# Altium project BC8SATEV1.0.PrjPCB
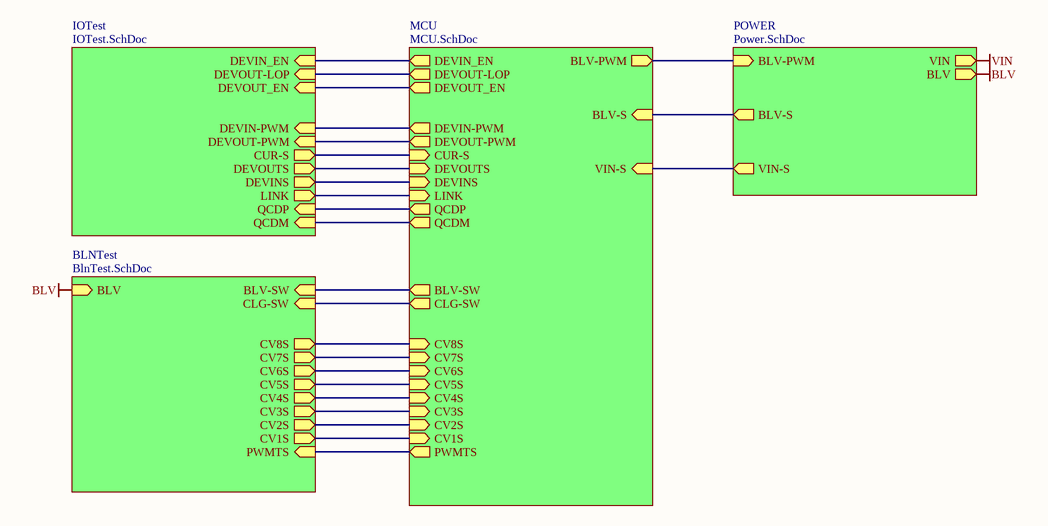
[diagram p0: Connection.SchDoc]
5 sheets, 346 parts. Net scope: hierarchical (ports join the sheet entries above them; power ports are global).
Board file: SCATEV33.PcbDoc
Sheets:
  Connection.SchDoc
    IOTest = IOTest.SchDoc
    MCU = MCU.SchDoc
    POWER = Power.SchDoc
    BLNTest = BlnTest.SchDoc

## Sheet Connection.SchDoc
size A4; DocumentNumber: 1; SheetNumber: 2; SheetTotal: 5

### Sub-sheets
BLNTest = BlnTest.SchDoc: BLV-SW (in), BLV (in), CLG-SW (in), CV5S (out), CV6S (out), CV7S (out), CV8S (out), CV3S (out), CV4S (out), CV2S (out), CV1S (out), PWMTS (in)
IOTest = IOTest.SchDoc: DEVINS (out), DEVOUTS (out), CUR-S (out), DEVOUT-LOP (in), DEVIN_EN (in), LINK (out), QCDP (in), QCDM (in), DEVOUT_EN (in), DEVIN-PWM (in), DEVOUT-PWM (in)
MCU = MCU.SchDoc: CV5S (in), CV6S (in), CV1S (in), CV7S (in), CV8S (in), CV3S (in), CV4S (in), CV2S (in), DEVOUTS (in), CUR-S (in), DEVINS (in), BLV-S (in), CLG-SW (out), BLV-SW (out), DEVOUT-LOP (out), DEVIN_EN (out), BLV-PWM (out), LINK (in), PWMTS (out), QCDP (out), QCDM (out), VIN-S (in), DEVOUT_EN (out), DEVIN-PWM (out), DEVOUT-PWM (out)
POWER = Power.SchDoc: BLV-PWM (in), BLV (out), BLV-S (out), VIN (out), VIN-S (out)

### Nets
BLV: sheet POWER/BLV, sheet BLNTest/BLV
BLV-SW: sheet MCU/BLV-SW, sheet BLNTest/BLV-SW
CLGC: sheet MCU/CLG-SW, sheet BLNTest/CLG-SW
QCDM: sheet IOTest/QCDM, sheet MCU/QCDM
QCDP: sheet IOTest/QCDP, sheet MCU/QCDP
NetC6_2: sheet MCU/CV7S, sheet BLNTest/CV7S
NetC7_2: sheet MCU/CV8S, sheet BLNTest/CV8S
NetC8_2: sheet MCU/CV5S, sheet BLNTest/CV5S
NetC9_2: sheet MCU/CV6S, sheet BLNTest/CV6S
NetC10_2: sheet MCU/CV3S, sheet BLNTest/CV3S
NetC11_2: sheet MCU/CV4S, sheet BLNTest/CV4S
NetC12_2: sheet MCU/CV1S, sheet BLNTest/CV1S
NetC13_2: sheet MCU/CV2S, sheet BLNTest/CV2S
NetC15_2: sheet IOTest/DEVOUTS, sheet MCU/DEVOUTS
NetC17_2: sheet IOTest/CUR-S, sheet MCU/CUR-S
NetC27_2: sheet MCU/BLV-S, sheet POWER/BLV-S
NetC47_2: sheet IOTest/DEVINS, sheet MCU/DEVINS
NetC64_2: sheet MCU/VIN-S, sheet POWER/VIN-S
NetP2_3: sheet IOTest/LINK, sheet MCU/LINK
NetQ5_1: sheet IOTest/DEVIN-PWM, sheet MCU/DEVIN-PWM
NetQ17_1: sheet IOTest/DEVOUT_EN, sheet MCU/DEVOUT_EN
NetQ18_1: sheet IOTest/DEVOUT-PWM, sheet MCU/DEVOUT-PWM
NetQ43_1: sheet IOTest/DEVOUT-LOP, sheet MCU/DEVOUT-LOP
NetQ47_1: sheet MCU/BLV-PWM, sheet POWER/BLV-PWM
NetQ53_1: sheet MCU/PWMTS, sheet BLNTest/PWMTS
NetR43_2: sheet IOTest/DEVIN_EN, sheet MCU/DEVIN_EN

## Sheet IOTest.SchDoc
size A3; DocumentNumber: 5; SheetNumber: 5; SheetTotal: 5
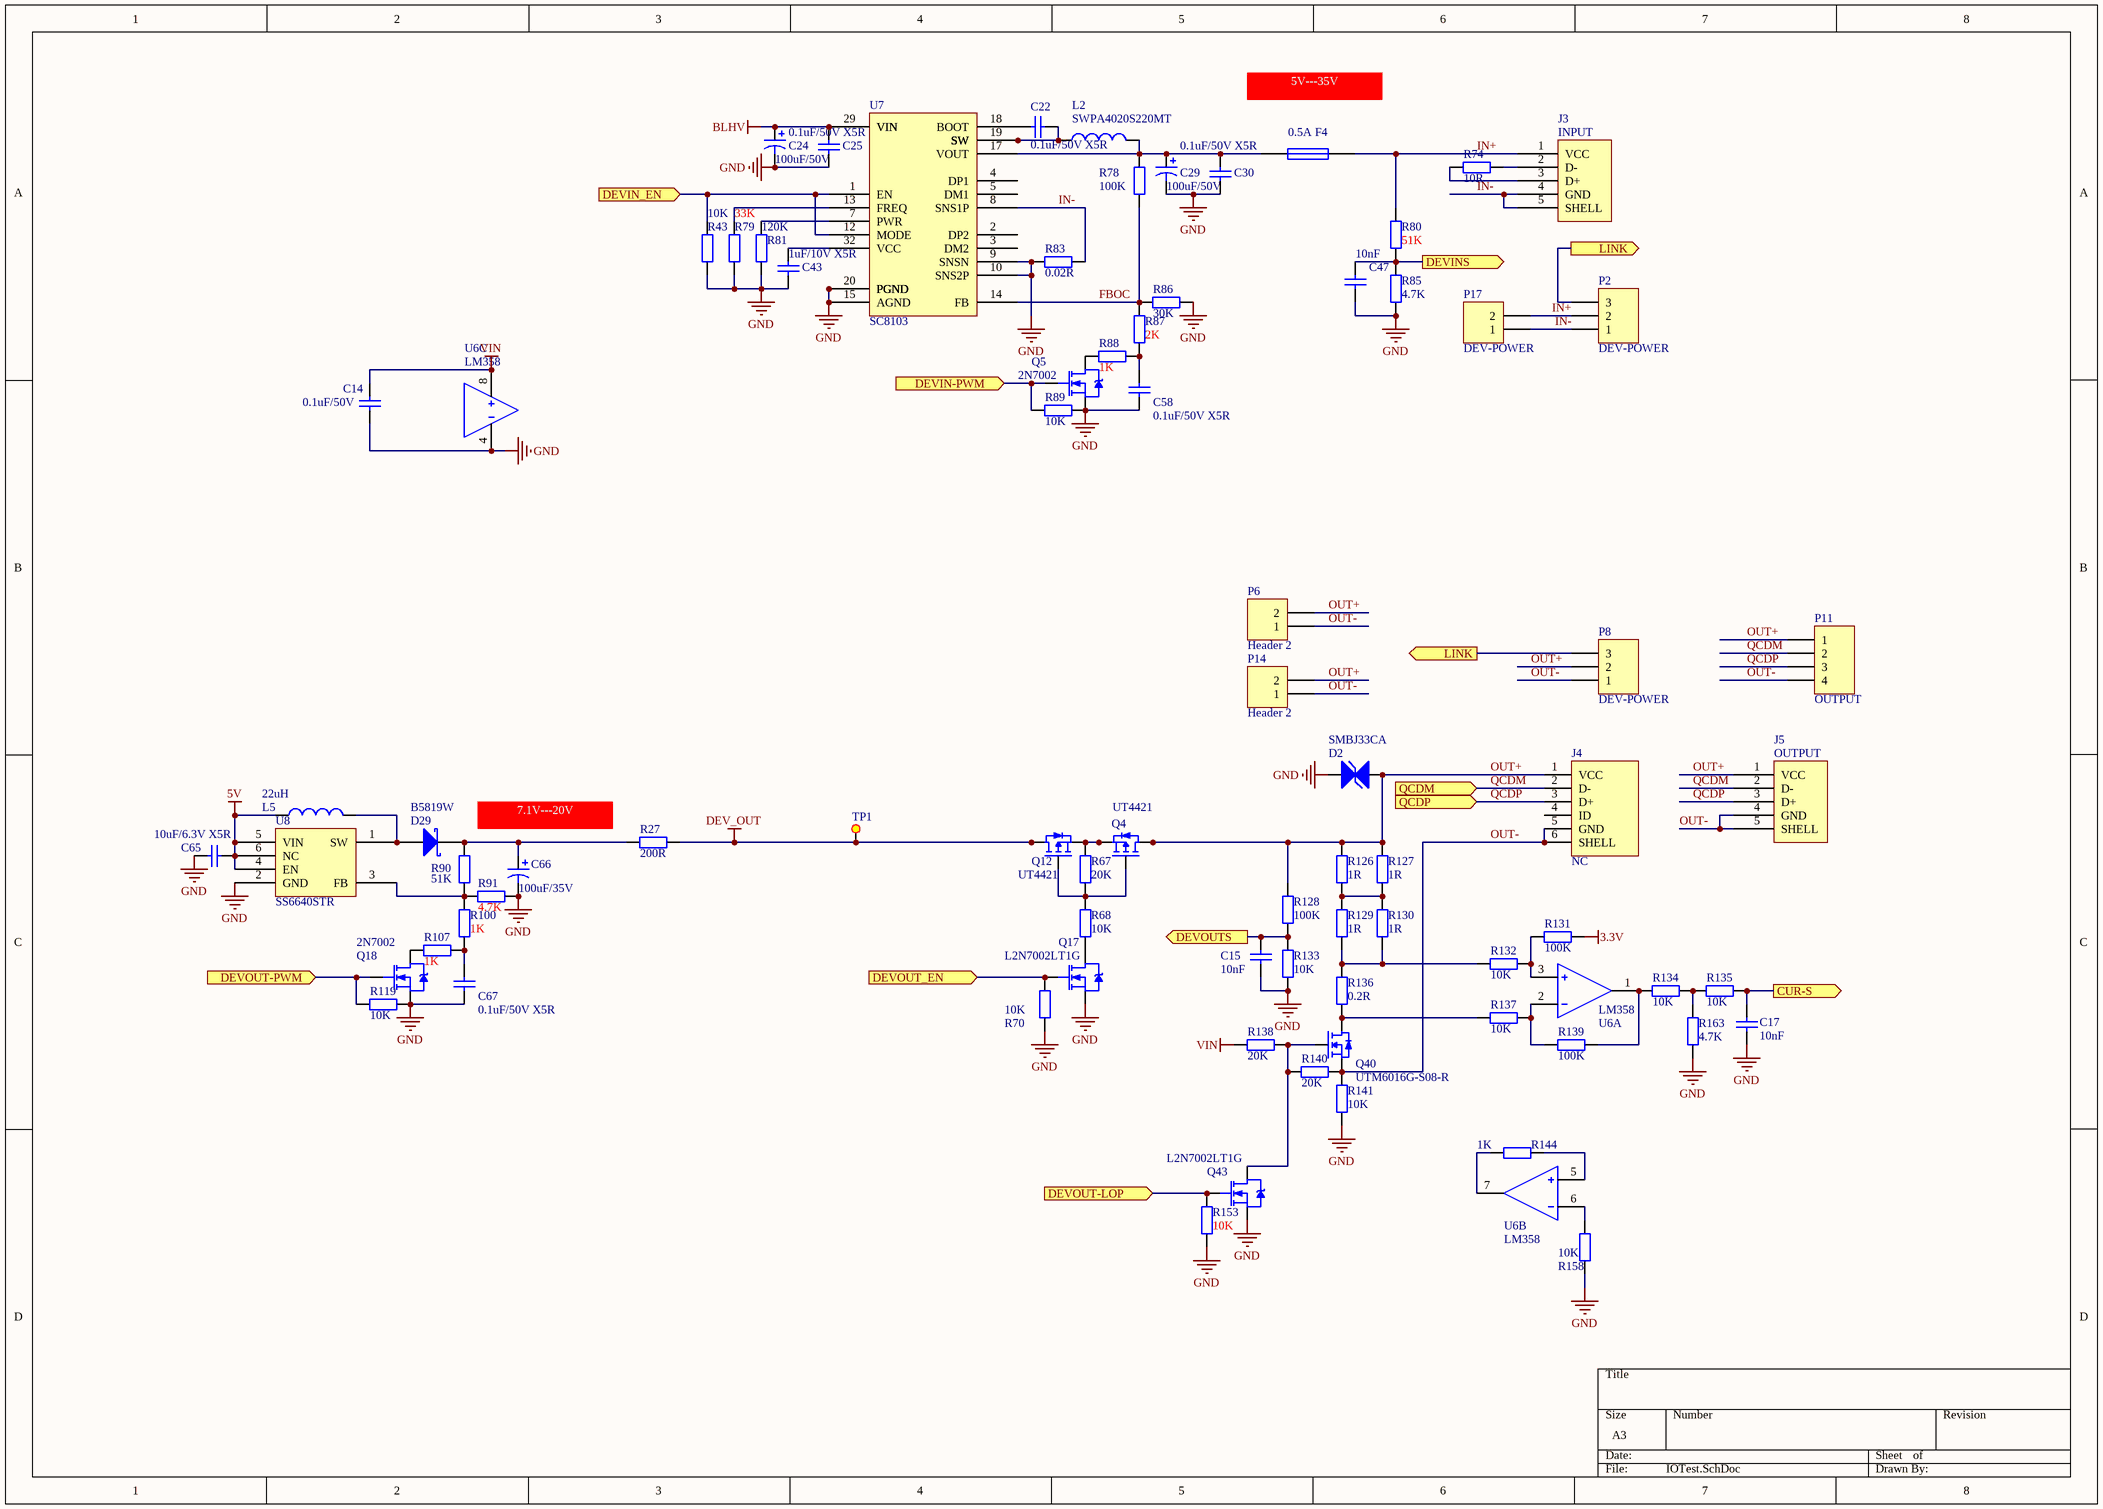
[diagram p1: IOTest.SchDoc]

### Parts
C14  0.1uF/50V  [C-0603]
C15  10nF  [C-0603]
C17  10nF  [C-0603]
C22  0.1uF/50V X5R  [C-0603]
C24  100uF/50V  [CAPPR-8x12]
C25  0.1uF/50V X5R  [C-0603]
C29  100uF/50V  [CAPPR-8x12]
C30  0.1uF/50V X5R  [C-0603]
C43  1uF/10V X5R  [C-0603]
C47  10nF  [C-0603]
C58  0.1uF/50V X5R  [C-0603]
C65  10uF/6.3V X5R  [C-0603]
C66  100uF/35V  [CAP-SMD-6.3x7.7]
C67  0.1uF/50V X5R  [C-0603]
D2  SMBJ33CA  [SMBJ]
D29  B5819W  [SOD-123FL]
F4  0.5A  [R-1206]
J3  INPUT  [ST-001-15A-1.0]
J4  NC  [ST-MICROUSB-03A]
J5  OUTPUT  [ST-001-15A-1.0]
L2  SWPA4020S220MT  [SWPA4020S]
L5  22uH  [DG3521]
P2  DEV-POWER  [XH 2.54-3P]
P6  Header 2  [XH 2.54-2P]
P8  DEV-POWER  [XH 2.54-3P]
P11  OUTPUT  [XH 2.54-4P]
P14  Header 2  [XH 2.54-2P]
P17  DEV-POWER  [XH 2.54-2P]
Q4  UT4421  [SOIC8]
Q5  2N7002  [SOT23-3]
Q12  UT4421  [SOIC8]
Q17  L2N7002LT1G  [SOT23-3]
Q18  2N7002  [SOT23-3]
Q40  UTM6016G-S08-R  [SOIC8]
Q43  L2N7002LT1G  [SOT23-3]
R27  200R  [R-0805]
R43  10K  [R-0603]
R67  20K  [R-0603]
R68  10K  [R-0603]
R70  10K  [R-0603]
R74  10R  [R-0603]
R78  100K  [R-0603]
R79  33K  [R-0603]
R80  51K  [R-0603]
R81  120K  [R-0603]
R83  0.02R  [R-2010]
R85  4.7K  [R-0603]
R86  30K  [R-0603]
R87  2K  [R-0603]
R88  1K  [R-0603]
R89  10K  [R-0603]
R90  51K  [R-0603]
R91  4.7K  [R-0603]
R100  1K  [R-0603]
R107  1K  [R-0603]
R119  10K  [R-0603]
R126  1R  [R-2512]
R127  1R  [R-2512]
R128  100K  [R-0603]
R129  1R  [R-2512]
R130  1R  [R-2512]
R131  100K  [R-0603]
R132  10K  [R-0603]
R133  10K  [R-0603]
R134  10K  [R-0603]
R135  10K  [R-0603]
R136  0.2R  [R-2512HP]
R137  10K  [R-0603]
R138  20K  [R-0603]
R139  100K  [R-0603]
R140  20K  [R-0603]
R141  10K  [R-0603]
R144  1K  [R-0603]
R153  10K  [R-0603]
R158  10K  [R-0603]
R163  4.7K  [R-0603]
TP1  (no value)  [TestPoint-1.5mm]
U6  LM358  [SOIC8]  (parts A,B,C of 3)
U7  SC8103  [SC8103]
U8  SS6640STR  [SOT23-6]

### Ports
CUR-S (out), DEVIN-PWM (in), DEVIN_EN (in), DEVINS (out), DEVOUT-LOP (in), DEVOUT-PWM (in), DEVOUT_EN (in), DEVOUTS (out), LINK (out), QCDM (in), QCDP (in)

### Nets
3.3V: R131.2
5V: C65.2 L5.1 U8.4(EN) U8.5(VIN) U8.6(NC)
BLHV: C24.1 C25.2 U7.29(VIN) U7.30(VIN) U7.31(VIN)
DEV_OUT: Q12.5(D) Q12.6(D) Q12.7(D) Q12.8(D) R27.2 TP1.1
GND: C14.2 C15.1 C17.1 C24.2 C25.1 C29.2 C30.1 C43.1 C47.1 C58.2 C65.1 C66.2 C67.2 D2.1 Q5.2(D) Q17.2(D) Q18.2(D) Q43.2(D) R43.1 R70.1 R79.1 R81.1 R83.1 R85.1 R86.1 R89.1 R91.2 R119.1 R133.1 R141.2 R153.2 R158.2 R163.1 U6.4 U7.9(SNSN) U7.10(SNS2P) U7.15(AGND) U7.20(PGND) U7.21(PGND) U7.22(PGND) U7.23(PGND) U7.24(PGND) U8.2(GND)
VIN: C14.1 R138.1 U6.8
FBOC: R78.2 R86.2 R87.2 U7.14(FB)
IN+: F4.2 J3.1(VCC) P2.2 P17.2 R80.2
IN-: J3.4(GND) J3.5(SHELL) P2.1 P17.1 R83.2 U7.8(SNS1P)
OUT+: D2.2 J4.1(VCC) J5.1(VCC) P6.2 P8.2 P11.1 P14.2 Q4.5(D) Q4.6(D) Q4.7(D) Q4.8(D) R126.1 R127.2 R128.2
OUT-: J4.5(GND) J4.6(SHELL) J5.4(GND) J5.5(SHELL) P6.1 P8.1 P11.4 P14.1 Q40.1(S) Q40.2(S) Q40.3(S) R140.2 R141.1
QCDM: J4.2(D-) J5.2(D-) P11.2 ; port QCDM
QCDP: J4.3(D+) J5.3(D+) P11.3 ; port QCDP
NetC15_2: C15.2 R128.1 R133.2 ; port DEVOUTS
NetC17_2: C17.2 R135.2 ; port CUR-S
NetC22_1: C22.1 L2.1 U7.16(SW) U7.19(SW) U7.25(SW) U7.26(SW) U7.27(SW) U7.28(SW)
NetC22_2: C22.2 U7.18(BOOT)
NetC29_1: C29.1 C30.2 F4.1 L2.2 R78.1 U7.17(VOUT)
NetC43_2: C43.2 U7.32(VCC)
NetC47_2: C47.2 R80.1 R85.2 ; port DEVINS
NetC58_1: C58.1 R87.1 R88.1
NetC66_1: C66.1 D29.2(K) R27.1 R90.1
NetC67_1: C67.1 R100.1 R107.1
NetD29_1: D29.1(A) L5.2 U8.1(SW)
NetJ3_2: J3.2(D-) R74.1
NetJ3_3: J3.3(D+) R74.2
NetP2_3: P2.3 P8.3 ; port LINK
NetQ4_1: Q4.1(S) Q4.2(S) Q4.3(S) Q12.1(S) Q12.2(S) Q12.3(S) R67.2
NetQ4_4: Q4.4(G) Q12.4(G) R67.1 R68.2
NetQ5_1: Q5.1(G) R89.2 ; port DEVIN-PWM
NetQ5_3: Q5.3(S) R88.2
NetQ17_1: Q17.1(G) R70.2 ; port DEVOUT_EN
NetQ17_3: Q17.3(S) R68.1
NetQ18_1: Q18.1(G) R119.2 ; port DEVOUT-PWM
NetQ18_3: Q18.3(S) R107.2
NetQ40_4: Q40.4(G) Q43.3(S) R138.2 R140.1
NetQ40_5: Q40.5(D) Q40.6(D) Q40.7(D) Q40.8(D) R136.1 R137.1
NetQ43_1: Q43.1(G) R153.1 ; port DEVOUT-LOP
NetR43_2: R43.2 U7.1(EN) U7.12(MODE) ; port DEVIN_EN
NetR79_2: R79.2 U7.13(FREQ)
NetR81_2: R81.2 U7.7(PWR)
NetR90_2: R90.2 R91.1 R100.2 U8.3(FB)
NetR126_2: R126.2 R127.1 R129.2 R130.1
NetR129_1: R129.1 R130.2 R132.1 R136.2
NetR131_1: R131.1 R132.2 U6.3
NetR134_1: R134.1 R139.2 U6.1
NetR134_2: R134.2 R135.1 R163.2
NetR137_2: R137.2 R139.1 U6.2
NetR144_1: R144.1 U6.5
NetR144_2: R144.2 U6.7
NetR158_1: R158.1 U6.6

Not connected (* = marked no-connect by the designer): J4 4(ID); U7 2(DP2) 3(DM2) 4(DP1) 5(DM1)

### Notes on the sheet
- 5V---35V
- 7.1V---20V

### Library data of the parts
C14 C15 C17 C22 C25 C30 C43 C47 C58 C65 C67 = Cap: Capacitor; Published: 8-Jun-2000; LatestRevisionDate: 17-Jul-2002; LatestRevisionNote: Re-released for DXP Platform.; PackageReference: RAD-0.3; Publisher: Altium Limited
  C14: Value: 0.1uF/50V
  C15 C17 C47: Value: 10nF
  C22 C25 C30 C58 C67: PackageDescription: Radial Cap, Thru-Hole; 2 Leads; 0.3 in Pin Spacing; Value: 0.1uF/50V X5R
  C43: PackageDescription: Radial Cap, Thru-Hole; 2 Leads; 0.3 in Pin Spacing; Value: 1uF/10V X5R
  C65: PackageDescription: Radial Cap, Thru-Hole; 2 Leads; 0.3 in Pin Spacing; Value: 10uF/6.3V X5R
C24 C29 C66 = Cap Pol1: Polarized Capacitor (Radial); Published: 8-Jun-2000; LatestRevisionDate: 17-Jul-2002; LatestRevisionNote: Re-released for DXP Platform.; PackageReference: RB7.6-15; Publisher: Altium Limited; PackageDescription: Polarized Capacitor (Radial); 2 Leads
  C24 C29: Value: 100uF/50V
  C66: Value: 100uF/35V
D2 = TVS-D
D29 = D Schottky: Schottky Diode; Published: 8-Jun-2000; LatestRevisionDate: 17-Jul-2002; LatestRevisionNote: Re-released for DXP Platform.; PackageReference: SMB; Publisher: Altium Limited; Code_JEDEC: DO-214-AA
F4 = Fuse 1: Fuse; Published: 8-Jun-2000; LatestRevisionDate: 17-Jul-2002; LatestRevisionNote: Re-released for DXP Platform.; PackageReference: PIN-W2/E2.8; Publisher: Altium Limited; PackageDescription: Thru-Hole; 2 Leads
J3 J5 = USB-CON: USB CONNECTOR
J4 = MICRO-USB-B
L2 L5 = Inductor: Code_IEC: 1005; Published: 8-Jun-2000; LatestRevisionDate: 29-May-2009; LatestRevisionNote: IPC-7351 Footprint Added.; PackageReference: 0402-A; Publisher: Altium Limited; PackageDescription: Chip Inductor; Code_JEITA: 0402
  L2: Value: SWPA4020S220MT
  L5: Value: 22uH
P2 P8 = Header 3: Header, 3-Pin; LatestRevisionDate: 17-Jul-2002; LatestRevisionNote: Re-released for DXP Platform.; Publisher: Altium Limited
P6 P14 P17 = Header 2: Header, 2-Pin; LatestRevisionDate: 17-Jul-2002; LatestRevisionNote: Re-released for DXP Platform.; Publisher: Altium Limited
P11 = Header 4: Header, 4-Pin; LatestRevisionDate: 17-Jul-2002; LatestRevisionNote: Re-released for DXP Platform.; Publisher: Altium Limited
Q4 Q12 = SO8-PMOS
Q5 Q17 Q18 Q43 = NMOS-2: N-Channel Power MOSFET; Note: Pin 2 is electrically connected to pin 4.; Published: 8-Jun-2000; LatestRevisionDate: 17-Jul-2002; LatestRevisionNote: Re-released for DXP Platform.; DatasheetVersion: PD-9.814; PackageVersion: Feb-1997; PackageReference: TO-220AB; Publisher: Altium Limited; PackageDescription: TO, Thru-Hole, Vertical, Heatsink Mounted; 3 In-Line Leads; Pitch 2.54 mm; ComponentLink1Description: Manufacturer Link; ComponentLink1URL: http://www.irf.com/
Q40 = SO8-NMOS
R27 R43 R67 R68 R70 R74 R78-R81 R83 R85-R91 R100 R107 R119 R126-R141 R144 R153 R158 R163 = Res2: Resistor; Published: 8-Jun-2000; LatestRevisionDate: 17-Jul-2002; LatestRevisionNote: Re-released for DXP Platform.; PackageReference: AXIAL-0.4; Publisher: Altium Limited
  R27: Value: 200R
  R43 R68 R70 R89 R119 R132-R135 R137 R141 R153 R158: Value: 10K
  R67 R138 R140: Value: 20K
  R74: Value: 10R
  R78 R128 R131 R139: Value: 100K
  R79: Value: 33K
  R80 R90: Value: 51K
  R81: Value: 120K
  R83: Value: 0.02R
  R85 R91 R163: Value: 4.7K
  R86: Value: 30K
  R87: Value: 2K
  R88 R100 R107 R144: Value: 1K
  R126 R127 R129 R130: Value: 1R
  R136: Value: 0.2R
TP1 = TEST_P
U6 = Dual_OPAMP
U8 = AX5523

## Sheet MCU.SchDoc
size A2; DocumentNumber: 2; SheetNumber: 1; SheetTotal: 5
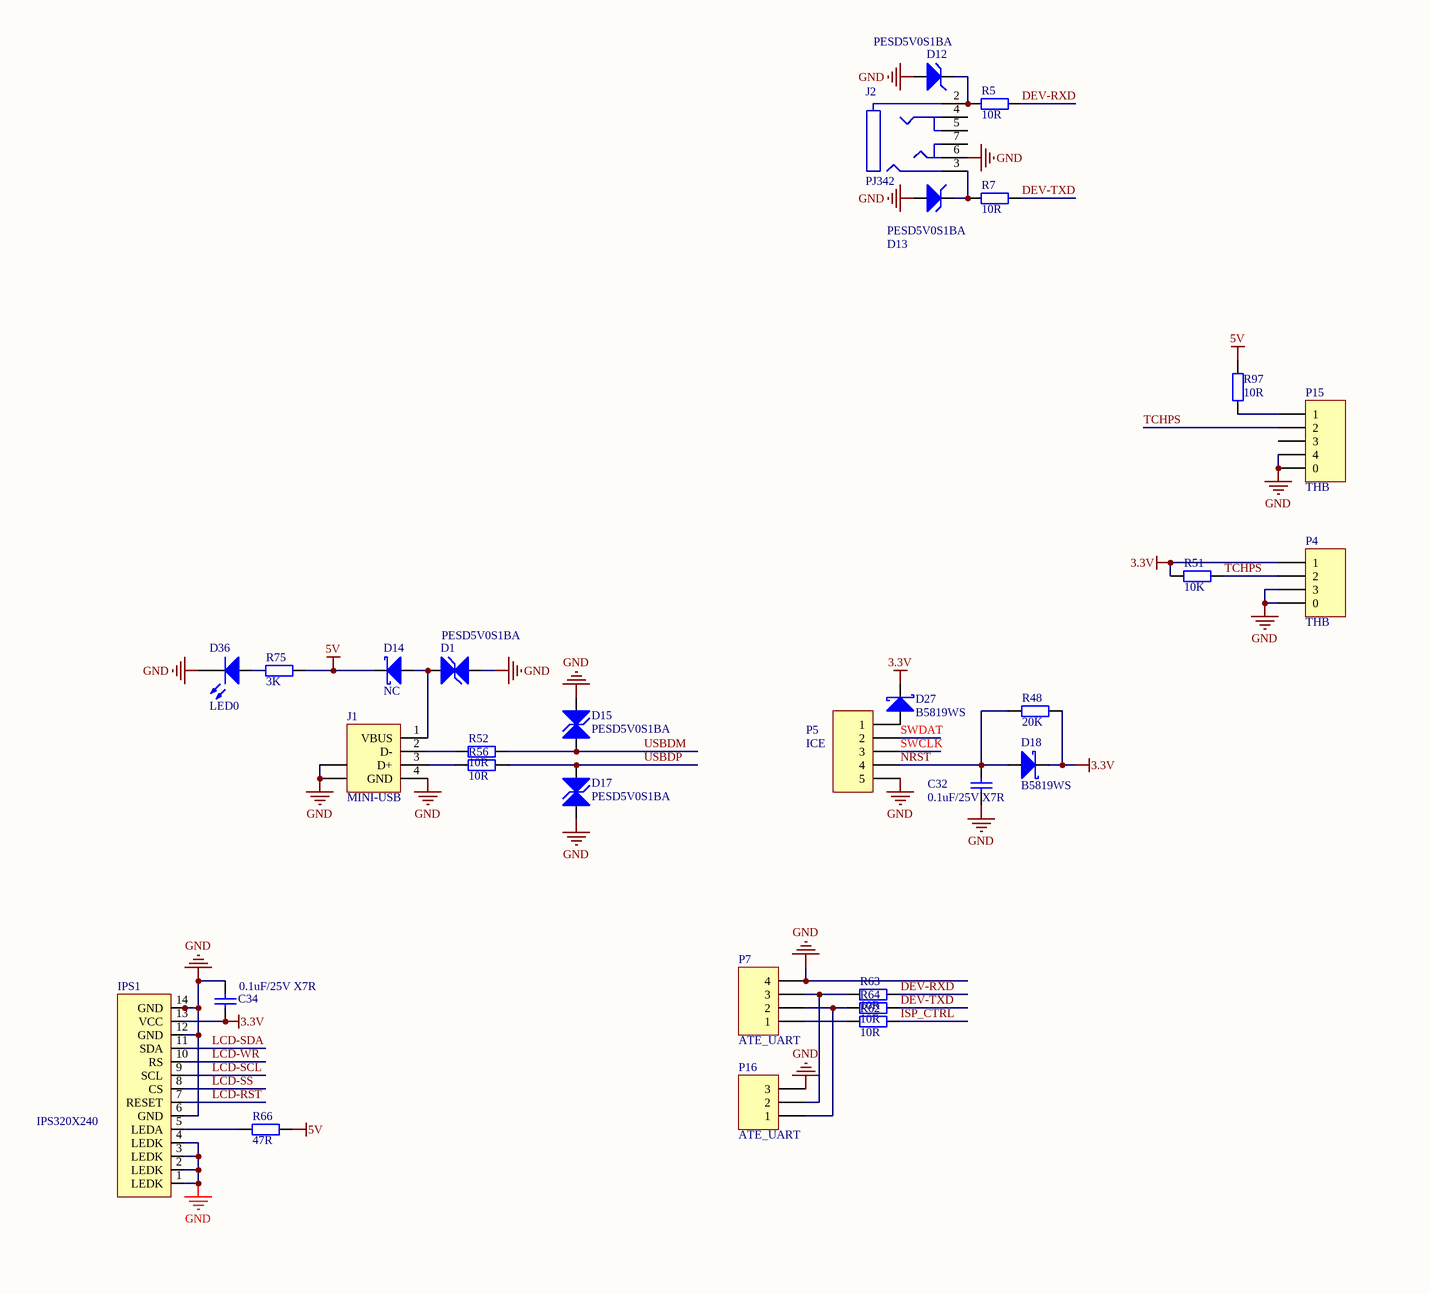
[diagram p2: MCU.SchDoc, left]
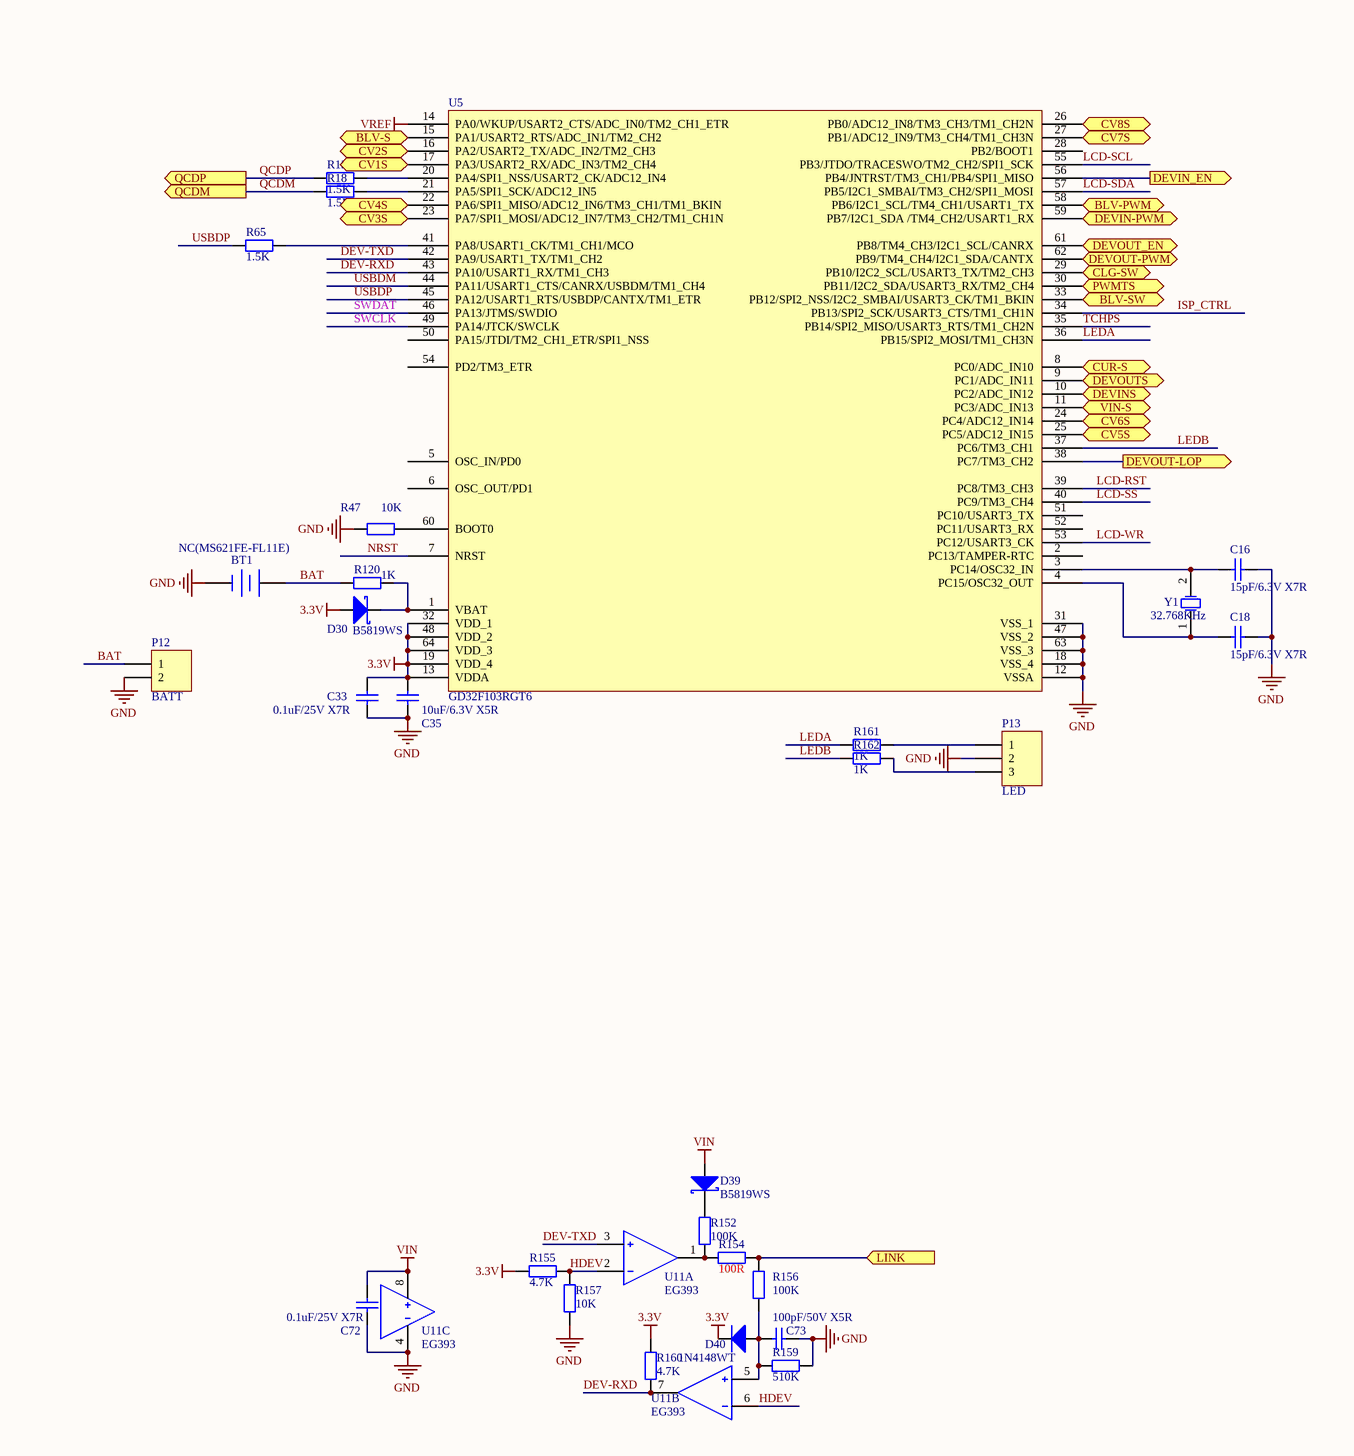
[diagram p3: MCU.SchDoc, right]

### Parts
BT1  NC(MS621FE-FL11E)  [MS621FE FL11E]
C16  15pF/6.3V X7R  [C-0603]
C18  15pF/6.3V X7R  [C-0603]
C32  0.1uF/25V X7R  [C-0603]
C33  0.1uF/25V X7R  [C-0603]
C34  0.1uF/25V X7R  [C-0603]
C35  10uF/6.3V X5R  [C-0603]
C72  0.1uF/25V X7R  [C-0603]
C73  100pF/50V X5R  [C-0603]
D1  PESD5V0S1BA  [SOD-323]
D12  PESD5V0S1BA  [SOD-323]
D13  PESD5V0S1BA  [SOD-323]
D14  NC  [SOD-323]
D15  PESD5V0S1BA  [SOD-323]
D17  PESD5V0S1BA  [SOD-323]
D18  B5819WS  [SOD-323]
D27  B5819WS  [SOD-323]
D30  B5819WS  [SOD-323]
D36  LED0  [LED-SMD-0603]
D39  B5819WS  [SOD-323]
D40  1N4148WT  [SOD-323]
IPS1  IPS320X240  [0.5K-AS-NPWB-14P]
J1  MINI-USB  [USB-MINI-C]
J2  PJ342  [PJ342]
P4  THB  [1.25T-3P-SMT]
P5  ICE  [1.25T-5P]
P7  ATE_UART  [XH 2.54-4P]
P12  BATT  [PH-2A]
P13  LED  [HDR1X3]
P15  THB  [1.25T-4P-SMT]
P16  ATE_UART  [XH 2.54-3P]
R5  10R  [R-0603]
R7  10R  [R-0603]
R13  1.5K  [R-0603]
R18  1.5K  [R-0603]
R47  10K  [R-0603]
R48  20K  [R-0603]
R51  10K  [R-0603]
R52  10R  [R-0603]
R56  10R  [R-0603]
R62  10R  [R-0603]
R63  10R  [R-0603]
R64  10R  [R-0603]
R65  1.5K  [R-0603]
R66  47R  [R-0805]
R75  3K  [R-0603]
R97  10R  [R-0603]
R120  1K  [R-0603]
R152  100K  [R-0603]
R154  100R  [R-0603]
R155  4.7K  [R-0603]
R156  100K  [R-0603]
R157  10K  [R-0603]
R159  510K  [R-0603]
R160  4.7K  [R-0603]
R161  1K  [R-0603]
R162  1K  [R-0603]
U5  GD32F103RGT6  [TSQFP50P1200X1200X160-64N]
U11  EG393  [SOIC8]  (parts A,B,C of 3)
Y1  32.768KHz  [DT-38]

### Ports
BLV-PWM (out), BLV-S (in), BLV-SW (out), CLG-SW (out), CUR-S (in), CV1S (in), CV2S (in), CV3S (in), CV4S (in), CV5S (in), CV6S (in), CV7S (in), CV8S (in), DEVIN-PWM (out), DEVIN_EN (out), DEVINS (in), DEVOUT-LOP (out), DEVOUT-PWM (out), DEVOUT_EN (out), DEVOUTS (in), LINK (in), PWMTS (out), QCDM (out), QCDP (out), VIN-S (in)

### Nets
3.3V: C33.2 C34.2 C35.2 D18.2(K) D27.2(K) D30.1(A) D40.2(K) IPS1.13(VCC) P4.1 R48.1 R51.2 R155.2 R160.2 U5.13(VDDA) U5.19(VDD_4) U5.32(VDD_1) U5.48(VDD_2) U5.64(VDD_3)
5V: D14.2(K) R66.2 R75.1 R97.2
GND: BT1.2(-) C16.1 C18.1 C32.2 C33.1 C34.1 C35.1 C72.2 C73.1 D1.1 D12.1(A) D13.1(A) D15.1 D17.1 D36.2(K) IPS1.0 IPS1.1(LEDK) IPS1.2(LEDK) IPS1.3(LEDK) IPS1.4(LEDK) IPS1.6(GND) IPS1.12(GND) IPS1.14(GND) J1.4(GND) J1.5(SHLD) J1.6(SHLD) J2.6 P4.0 P4.3 P5.5 P7.4 P12.2 P13.2 P15.0 P15.4 P16.3 R47.2 R157.1 R159.1 U5.12(VSSA) U5.18(VSS_4) U5.31(VSS_1) U5.47(VSS_2) U5.63(VSS_3) U11.4
VIN: C72.1 D39.1(A) U11.8
VREF: U5.14(PA0/WKUP/USART2_CTS/ADC_IN0/TM2_CH1_ETR)
BAT: BT1.1(+) P12.1 R120.2
BLV-SW: U5.33(PB12/SPI2_NSS/I2C2_SMBAI/USART3_CK/TM1_BKIN) ; port BLV-SW
CLGC: U5.29(PB10/I2C2_SCL/USART3_TX/TM2_CH3) ; port CLG-SW
DEV-RXD: R5.1 R63.1 R160.1 U5.43(PA10/USART1_RX/TM1_CH3) U11.7
DEV-TXD: R7.2 R64.1 U5.42(PA9/USART1_TX/TM1_CH2) U11.3
HDEV: R155.1 R157.2 U11.2 U11.6
ISP_CTRL: R62.1 U5.34(PB13/SPI2_SCK/USART3_CTS/TM1_CH1N)
LCD-RST: IPS1.7(RESET) U5.39(PC8/TM3_CH3)
LCD-SCL: IPS1.9(SCL) U5.55(PB3/JTDO/TRACESWO/TM2_CH2/SPI1_SCK)
LCD-SDA: IPS1.11(SDA) U5.57(PB5/I2C1_SMBAI/TM3_CH2/SPI1_MOSI)
LCD-SS: IPS1.8(CS) U5.40(PC9/TM3_CH4)
LCD-WR: IPS1.10(RS) U5.53(PC12/USART3_CK)
LEDA: R161.2 U5.36(PB15/SPI2_MOSI/TM1_CH3N)
LEDB: R162.2 U5.37(PC6/TM3_CH1)
NRST: C32.1 D18.1(A) P5.4 R48.2 U5.7(NRST)
QCDM: R18.2 ; port QCDM
QCDP: R13.2 ; port QCDP
SWCLK: P5.3 U5.49(PA14/JTCK/SWCLK)
SWDAT: P5.2 U5.46(PA13/JTMS/SWDIO)
TCHPS: P4.2 P15.2 R51.1 U5.35(PB14/SPI2_MISO/USART3_RTS/TM1_CH2N)
USBDM: D15.2 R52.1 U5.44(PA11/USART1_CTS/CANRX/USBDM/TM1_CH4)
USBDP: D17.2 R56.1 R65.1 U5.45(PA12/USART1_RTS/USBDP/CANTX/TM1_ETR)
NetC6_2: U5.27(PB1/ADC12_IN9/TM3_CH4/TM1_CH3N) ; port CV7S
NetC7_2: U5.26(PB0/ADC12_IN8/TM3_CH3/TM1_CH2N) ; port CV8S
NetC8_2: U5.25(PC5/ADC12_IN15) ; port CV5S
NetC9_2: U5.24(PC4/ADC12_IN14) ; port CV6S
NetC10_2: U5.23(PA7/SPI1_MOSI/ADC12_IN7/TM3_CH2/TM1_CH1N) ; port CV3S
NetC11_2: U5.22(PA6/SPI1_MISO/ADC12_IN6/TM3_CH1/TM1_BKIN) ; port CV4S
NetC12_2: U5.17(PA3/USART2_RX/ADC_IN3/TM2_CH4) ; port CV1S
NetC13_2: U5.16(PA2/USART2_TX/ADC_IN2/TM2_CH3) ; port CV2S
NetC15_2: U5.9(PC1/ADC_IN11) ; port DEVOUTS
NetC16_2: C16.2 U5.3(PC14/OSC32_IN) Y1.2(OSC2)
NetC17_2: U5.8(PC0/ADC_IN10) ; port CUR-S
NetC18_2: C18.2 U5.4(PC15/OSC32_OUT) Y1.1(OSC1)
NetC27_2: U5.15(PA1/USART2_RTS/ADC_IN1/TM2_CH2) ; port BLV-S
NetC47_2: U5.10(PC2/ADC_IN12) ; port DEVINS
NetC64_2: U5.11(PC3/ADC_IN13) ; port VIN-S
NetC73_2: C73.2 D40.1(A) R156.2 R159.2 U11.5
NetD1_2: D1.2 D14.1(A) J1.1(VBUS)
NetD12_2: D12.2(K) J2.2 R5.2
NetD13_2: D13.2(K) J2.3 R7.1
NetD27_1: D27.1(A) P5.1
NetD30_2: D30.2(K) R120.1 U5.1(VBAT)
NetD36_1: D36.1(A) R75.2
NetD39_2: D39.2(K) R152.1
NetIPS1_5: IPS1.5(LEDA) R66.1
NetJ1_2: J1.2(D-) R52.2
NetJ1_3: J1.3(D+) R56.2
NetP2_3: R154.1 R156.1 ; port LINK
NetP7_1: P7.1 R62.2
NetP7_2: P7.2 P16.1 R64.2
NetP7_3: P7.3 P16.2 R63.2
NetP13_1: P13.1 R161.1
NetP13_3: P13.3 R162.1
NetP15_1: P15.1 R97.1
NetQ5_1: U5.59(PB7/I2C1_SDA_/TM4_CH2/USART1_RX) ; port DEVIN-PWM
NetQ17_1: U5.61(PB8/TM4_CH3/I2C1_SCL/CANRX) ; port DEVOUT_EN
NetQ18_1: U5.62(PB9/TM4_CH4/I2C1_SDA/CANTX) ; port DEVOUT-PWM
NetQ43_1: U5.38(PC7/TM3_CH2) ; port DEVOUT-LOP
NetQ47_1: U5.58(PB6/I2C1_SCL/TM4_CH1/USART1_TX) ; port BLV-PWM
NetQ53_1: U5.30(PB11/I2C2_SDA/USART3_RX/TM2_CH4) ; port PWMTS
NetR13_1: R13.1 U5.20(PA4/SPI1_NSS/USART2_CK/ADC12_IN4)
NetR18_1: R18.1 U5.21(PA5/SPI1_SCK/ADC12_IN5)
NetR43_2: U5.56(PB4/JNTRST/TM3_CH1/PB4/SPI1_MISO) ; port DEVIN_EN
NetR47_1: R47.1 U5.60(BOOT0)
NetR65_2: R65.2 U5.41(PA8/USART1_CK/TM1_CH1/MCO)
NetR152_2: R152.2 R154.2 U11.1

Not connected (* = marked no-connect by the designer): J2 4 5 7; P15 3; U5 2(PC13/TAMPER-RTC) 5(OSC_IN/PD0) 6(OSC_OUT/PD1) 28(PB2/BOOT1) 50(PA15/JTDI/TM2_CH1_ETR/SPI1_NSS) 51(PC10/USART3_TX) 52(PC11/USART3_RX) 54(PD2/TM3_ETR)

### Library data of the parts
BT1 = Battery: Multicell Battery; Published: 24-Mar-1999; LatestRevisionDate: 17-Jul-2002; LatestRevisionNote: Re-released for DXP Platform.; PackageReference: BAT-2; Publisher: Altium Limited; PackageDescription: Battery; 2 Leads
C16 C18 C32-C35 C72 C73 = Cap: Capacitor; Published: 8-Jun-2000; LatestRevisionDate: 17-Jul-2002; LatestRevisionNote: Re-released for DXP Platform.; PackageReference: RAD-0.3; Publisher: Altium Limited; PackageDescription: Radial Cap, Thru-Hole; 2 Leads; 0.3 in Pin Spacing
  C16 C18: Value: 15pF/6.3V X7R
  C32-C34 C72: Value: 0.1uF/25V X7R
  C35: Value: 10uF/6.3V X5R
  C73: Value: 100pF/50V X5R
D1 D15 D17 = TVS-D
D12 D13 = D Zener: Zener Diode; Published: 8-Jun-2000; LatestRevisionDate: 17-Jul-2002; LatestRevisionNote: Re-released for DXP Platform.; PackageReference: DIODE-0.7; Publisher: Altium Limited; PackageDescription: Diode, Thru-Hole; 2 Leads; 0.7 in Pin Spacing
D14 D27 = D Schottky: Schottky Diode; Manufacturer: Generic Components; Class: Discrete; SubClass: Diode - Schottky; Published: 08/06/2000; Publisher: Altium Hobart Technology Centre
D18 D30 D39 = D Schottky: Schottky Diode; Published: 8-Jun-2000; LatestRevisionDate: 17-Jul-2002; LatestRevisionNote: Re-released for DXP Platform.; PackageReference: SMB; Publisher: Altium Limited; Code_JEDEC: DO-214-AA
D36 = LED0: Typical INFRARED GaAs LED; Published: 8-Jun-2000; LatestRevisionDate: 08-Jul-2005; LatestRevisionNote: Mech Layer 1 removed.; PackageReference: LED-0; Publisher: Altium Limited; PackageDescription: LED; 2 Leads
D40 = Diode: Default Diode; Published: 8-Jun-2000; LatestRevisionDate: 17-Jul-2002; LatestRevisionNote: Re-released for DXP Platform.; PackageVersion: Sep-1996; PackageReference: SMC; Publisher: Altium Limited; PackageDescription: DO-214-AB/SMC; 2 C-Bend Leads; Body 7.9 x 5.9 mm, inc. leads (LxW); Code_JEDEC: DO-214-AB
IPS1 = IPS320X240-14
J1 = 440314-1: USB 1.1, Right Angle, Thru-Hole, Series A, Reverse Type, Receptacle, 4 Position, Black; ContactMaterial: Copper Alloy; ContactPlating: Gold (30); TerminationLength: 2.22mm [0.088in.]; PCB_Layout: Complies with manufacturer's recommendation.; DrillSize: Corresponds to nominal value.; PanelGround: Without; Published: 15-Jul-2004; DatasheetDocument: 08-Sep-2003; PackageDocument: 08-Sep-2003; PackageReference: 440314; Publisher: Altium Limited; HousingMaterial: Glass-Filled Thermoplastic; ComponentLink1Description: Manufacturer Link; ComponentLink1URL: http://www.tycoelectronics.com/; ComponentLink2Description: Packaging Specification; ComponentLink2URL: http://ecommas.tycoelectronics.com/commerce/DocumentDelivery/DDEController?Action=showdoc&DocId=Customer+Drawing%7F440314%7FF%7Ftif%7FEnglish%7FC_440314_F.tif
P4 P7 = Header 4: Header, 4-Pin; LatestRevisionDate: 17-Jul-2002; LatestRevisionNote: Re-released for DXP Platform.; Publisher: Altium Limited
P5 P15 = Header 5: Header, 5-Pin; LatestRevisionDate: 17-Jul-2002; LatestRevisionNote: Re-released for DXP Platform.; Publisher: Altium Limited
P12 = Header 2: Header, 2-Pin; LatestRevisionDate: 17-Jul-2002; LatestRevisionNote: Re-released for DXP Platform.; Publisher: Altium Limited
P13 = Header 3: 共阴双色LED; LatestRevisionDate: 17-Jul-2002; LatestRevisionNote: Re-released for DXP Platform.; Publisher: Altium Limited
P16 = Header 3: Header, 3-Pin; LatestRevisionDate: 17-Jul-2002; LatestRevisionNote: Re-released for DXP Platform.; Publisher: Altium Limited
R5 R7 R13 R18 R47 R48 R51 R52 R56 R62-R66 R75 R97 R120 R152 R154-R157 R159-R162 = Res2: Resistor; Published: 8-Jun-2000; LatestRevisionDate: 17-Jul-2002; LatestRevisionNote: Re-released for DXP Platform.; PackageReference: AXIAL-0.4; Publisher: Altium Limited
  R5 R7 R97: Value: 10R
  R13 R18 R65: PackageDescription: Axial Device, Thru-Hole; 2 Leads; 0.4 in Pin Spacing; Value: 1.5K
  R47 R51 R157: Value: 10K
  R48: Value: 20K
  R52 R56 R62-R64: PackageDescription: Axial Device, Thru-Hole; 2 Leads; 0.4 in Pin Spacing; Value: 10R
  R66: Value: 47R
  R75: PackageDescription: Axial Device, Thru-Hole; 2 Leads; 0.4 in Pin Spacing; Value: 3K
  R120: Value: 1K
  R152 R156: Value: 100K
  R154: Value: 100R
  R155 R160: Value: 4.7K
  R159: Value: 510K
  R161 R162: PackageDescription: Axial Device, Thru-Hole; 2 Leads; 0.4 in Pin Spacing; Value: 1K
U5 = GD32F103RBT6: STM32 ARM-based 32-bit MCU with 128 Kbytes Flash, 64-pin LQFP, Industrial Temperature; Published: *; DatasheetVersion: *; PackageVersion: *; PackageReference: *; Publisher: *; PackageDescription: *; ComponentLink1Description: *; ComponentLink1URL: *; ComponentLink2Description: *; ComponentLink2URL: *
U11 = Dual_OPAMP
Y1 = XTAL: Crystal Oscillator; Published: 8-Jun-2000; LatestRevisionDate: 17-Jul-2002; LatestRevisionNote: Re-released for DXP Platform.; PackageReference: R38; Publisher: Altium Limited; PackageDescription: Crystal, Thru-Hole; 2 Leads; Body 3.1 x 8.2 mm (Dia.xH)

## Sheet Power.SchDoc
size A4; DocumentNumber: 3; SheetNumber: 3; SheetTotal: 5
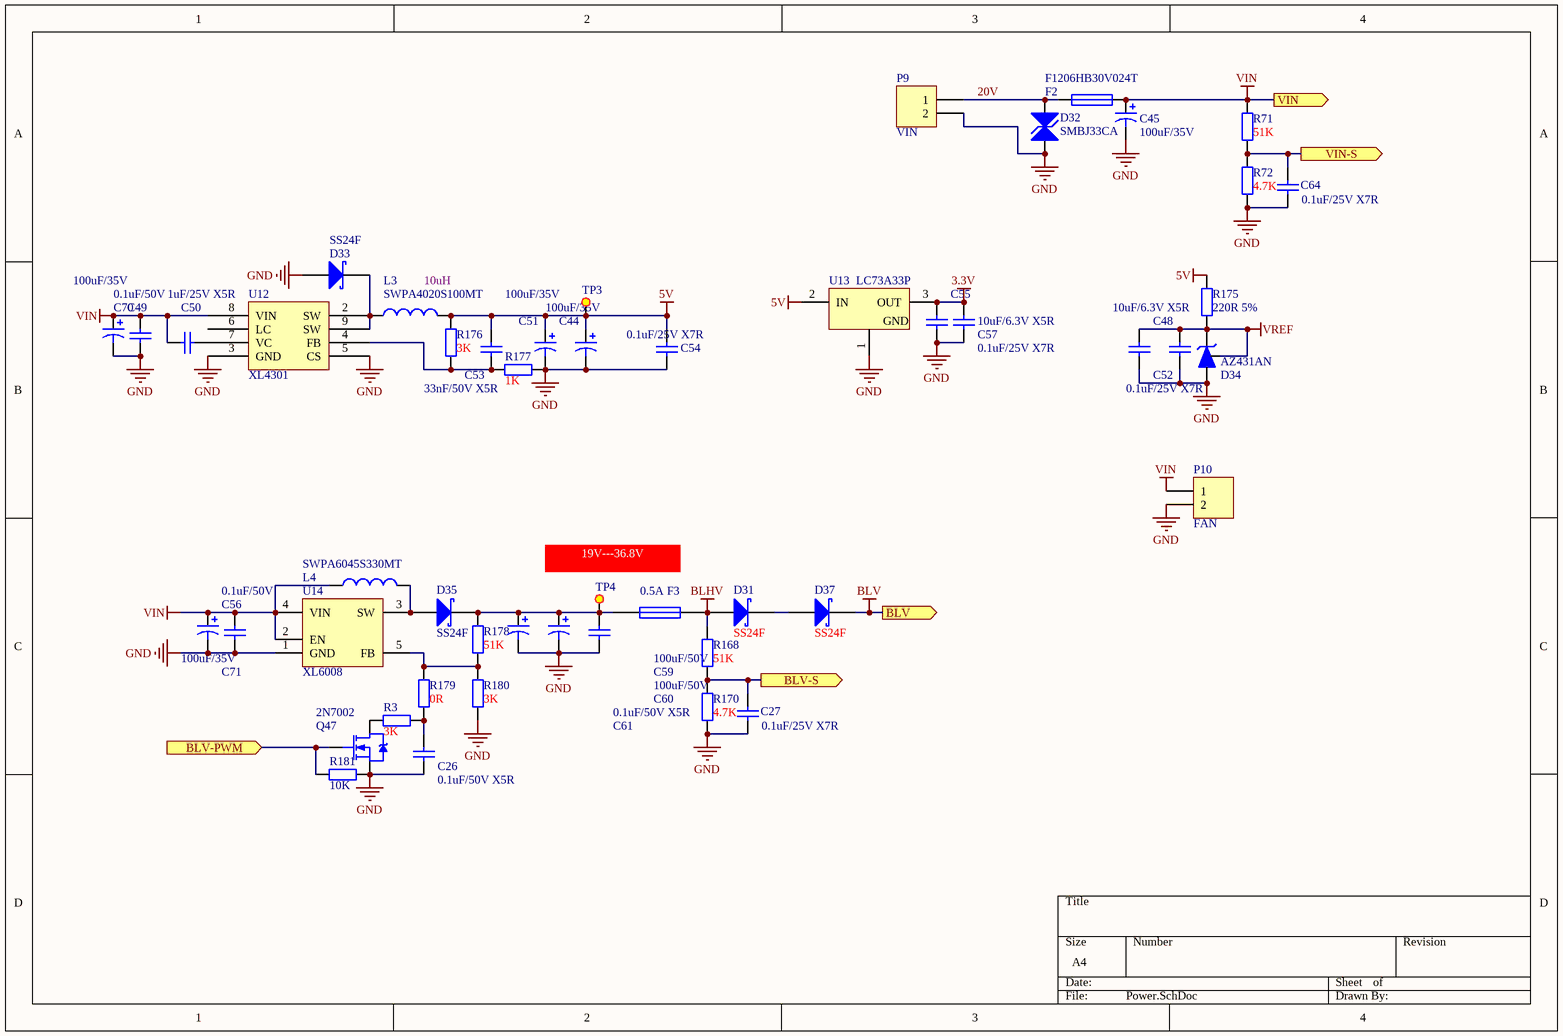
[diagram p4: Power.SchDoc]

### Parts
C26  0.1uF/50V X5R  [C-0603]
C27  0.1uF/25V X7R  [C-0603]
C44  100uF/35V  [CAP-SMD-6.3x7.7]
C45  100uF/35V  [CAP-SMD-6.3x7.7]
C48  10uF/6.3V X5R  [C-0603]
C49  0.1uF/50V  [C-0603]
C50  1uF/25V X5R  [C-0603]
C51  100uF/35V  [CAP-SMD-6.3x7.7]
C52  0.1uF/25V X7R  [C-0603]
C53  33nF/50V X5R  [C-0603]
C54  0.1uF/25V X7R  [C-0603]
C55  0.1uF/25V X7R  [C-0603]
C56  0.1uF/50V  [C-0603]
C57  10uF/6.3V X5R  [C-0603]
C59  100uF/50V  [CAPPR-8x12]
C60  100uF/50V  [CAPPR-8x12]
C61  0.1uF/50V X5R  [C-0603]
C64  0.1uF/25V X7R  [C-0603]
C70  100uF/35V  [CAP-SMD-6.3x7.7]
C71  100uF/35V  [CAP-SMD-6.3x7.7]
D31  SS24F  [SMAF]
D32  SMBJ33CA  [SMBJ]
D33  SS24F  [SMAF]
D34  AZ431AN  [SOT23-3]
D35  SS24F  [SMAF]
D37  SS24F  [SMAF]
F2  F1206HB30V024T  [R-1206]
F3  0.5A  [R-1206]
L3  SWPA4020S100MT  [SWPA4020S]
L4  SWPA6045S330MT  [SWPA6045S]
P9  VIN  [XT30U]
P10  FAN  [PH-2A]
Q47  2N7002  [SOT23-3]
R3  3K  [R-0603]
R71  51K  [R-0603]
R72  4.7K  [R-0603]
R168  51K  [R-0603]
R170  4.7K  [R-0603]
R175  220R 5%  [R-0603]
R176  3K  [R-0603]
R177  1K  [R-0603]
R178  51K  [R-0603]
R179  0R  [R-0603]
R180  3K  [R-0603]
R181  10K  [R-0603]
TP3  (no value)  [TestPoint-1.5mm]
TP4  (no value)  [TestPoint-1.5mm]
U12  XL4301  [SOIC8E]
U13  LC73A33P  [SOT89-3]
U14  XL6008  [TO252-5L]

### Ports
BLV (out), BLV-PWM (in), BLV-S (out), VIN (out), VIN-S (out)

### Nets
3.3V: C55.2 C57.2 U13.3(OUT)
5V: C44.1 C51.1 C53.1 C54.1 L3.2 R175.2 R176.1 TP3.1 U13.2(IN)
BLHV: D31.1(A) F3.2 R168.1
BLV: D37.2(K) ; port BLV
GND: C26.2 C27.1 C44.2 C45.2 C48.1 C49.1 C51.2 C52.2 C54.2 C55.1 C56.1 C57.1 C59.2 C60.2 C61.1 C64.1 C70.2 C71.2 D32.2 D33.1(A) D34.3(A) P9.2 P10.2 Q47.2(D) R72.1 R170.1 R177.2 R180.1 R181.1 U12.3(GND) U12.5(CS) U13.1(GND) U14.1(GND)
VIN: C45.1 C49.2 C50.2 C56.2 C70.1 C71.1 F2.1 L4.1 P10.1 R71.1 U12.8(VIN) U14.2(EN) U14.4(VIN) ; port VIN
VREF: C48.2 C52.1 D34.1(R) D34.2(K) R175.1
20V: D32.1 F2.2 P9.1
NetC26_1: C26.1 R3.1 R179.1
NetC27_2: C27.2 R168.2 R170.2 ; port BLV-S
NetC50_1: C50.1 U12.7(VC)
NetC53_2: C53.2 R176.2 R177.1 U12.4(FB)
NetC59_1: C59.1 C60.1 C61.2 D35.2(K) F3.1 R178.1 TP4.1
NetC64_2: C64.2 R71.2 R72.2 ; port VIN-S
NetD31_2: D31.2(K) D37.1(A)
NetD33_2: D33.2(K) L3.1 U12.2(SW) U12.9(SW)
NetD35_1: D35.1(A) L4.2 U14.3(SW)
NetQ47_1: Q47.1(G) R181.2 ; port BLV-PWM
NetQ47_3: Q47.3(S) R3.2
NetR178_2: R178.2 R179.2 R180.2 U14.5(FB)

Not connected (* = marked no-connect by the designer): U12 6(LC)

### Notes on the sheet
- 10uH
- 19V---36.8V

### Library data of the parts
C26 C27 C48-C50 C52-C57 C61 C64 = Cap: Capacitor; Published: 8-Jun-2000; LatestRevisionDate: 17-Jul-2002; LatestRevisionNote: Re-released for DXP Platform.; PackageReference: RAD-0.3; Publisher: Altium Limited
  C26 C61: PackageDescription: Radial Cap, Thru-Hole; 2 Leads; 0.3 in Pin Spacing; Value: 0.1uF/50V X5R
  C27 C52 C54 C64: PackageDescription: Radial Cap, Thru-Hole; 2 Leads; 0.3 in Pin Spacing; Value: 0.1uF/25V X7R
  C48: PackageDescription: Radial Cap, Thru-Hole; 2 Leads; 0.3 in Pin Spacing; Value: 10uF/6.3V X5R
  C49 C56: PackageDescription: Radial Cap, Thru-Hole; 2 Leads; 0.3 in Pin Spacing; Value: 0.1uF/50V
  C50: PackageDescription: Radial Cap, Thru-Hole; 2 Leads; 0.3 in Pin Spacing; Value: 1uF/25V X5R
  C53: PackageDescription: Radial Cap, Thru-Hole; 2 Leads; 0.3 in Pin Spacing; Value: 33nF/50V X5R
  C55: Value: 0.1uF/25V X7R
  C57: Value: 10uF/6.3V X5R
C44 C45 C51 C59 C60 C70 C71 = Cap Pol1: Polarized Capacitor (Radial); Published: 8-Jun-2000; LatestRevisionDate: 17-Jul-2002; LatestRevisionNote: Re-released for DXP Platform.; PackageReference: RB7.6-15; Publisher: Altium Limited; PackageDescription: Polarized Capacitor (Radial); 2 Leads
  C44 C45 C51 C70 C71: Value: 100uF/35V
  C59 C60: Value: 100uF/50V
D31 D33 D35 D37 = D Schottky: as D14 on sheet MCU; Published: 08/06/2000; Publisher: Altium Hobart Technology Centre
D32 = TVS-D
D34 = TL431
F2 F3 = Fuse 1: Fuse; Published: 8-Jun-2000; LatestRevisionDate: 17-Jul-2002; LatestRevisionNote: Re-released for DXP Platform.; PackageReference: PIN-W2/E2.8; Publisher: Altium Limited; PackageDescription: Thru-Hole; 2 Leads
L3 L4 = Inductor: Code_IEC: 1005; Published: 8-Jun-2000; LatestRevisionDate: 29-May-2009; LatestRevisionNote: IPC-7351 Footprint Added.; PackageReference: 0402-A; Publisher: Altium Limited; PackageDescription: Chip Inductor; Code_JEITA: 0402
  L3: Value: SWPA4020S100MT
  L4: Value: SWPA6045S330MT
P9 P10 = Header 2: Header, 2-Pin; LatestRevisionDate: 17-Jul-2002; LatestRevisionNote: Re-released for DXP Platform.; Publisher: Altium Limited
Q47 = NMOS-2: as Q5 on sheet IOTest; Published: 8-Jun-2000; LatestRevisionDate: 17-Jul-2002; LatestRevisionNote: Re-released for DXP Platform.; DatasheetVersion: PD-9.814; PackageVersion: Feb-1997; PackageReference: TO-220AB; Publisher: Altium Limited; PackageDescription: TO, Thru-Hole, Vertical, Heatsink Mounted; 3 In-Line Leads; Pitch 2.54 mm; ComponentLink1Description: Manufacturer Link; ComponentLink1URL: http://www.irf.com/
R3 R71 R72 R168 R170 R175-R181 = Res2: Resistor; Published: 8-Jun-2000; LatestRevisionDate: 17-Jul-2002; LatestRevisionNote: Re-released for DXP Platform.; PackageReference: AXIAL-0.4; Publisher: Altium Limited
  R3 R176 R180: Value: 3K
  R71 R168 R178: Value: 51K
  R72 R170: Value: 4.7K
  R175: Value: 220R 5%
  R177: Value: 1K
  R179: Value: 0R
  R181: Value: 10K
TP3 TP4 = TEST_P
U13 = LM7805

## Sheet BlnTest.SchDoc
size A3; DocumentNumber: 4; SheetNumber: 4; SheetTotal: 5
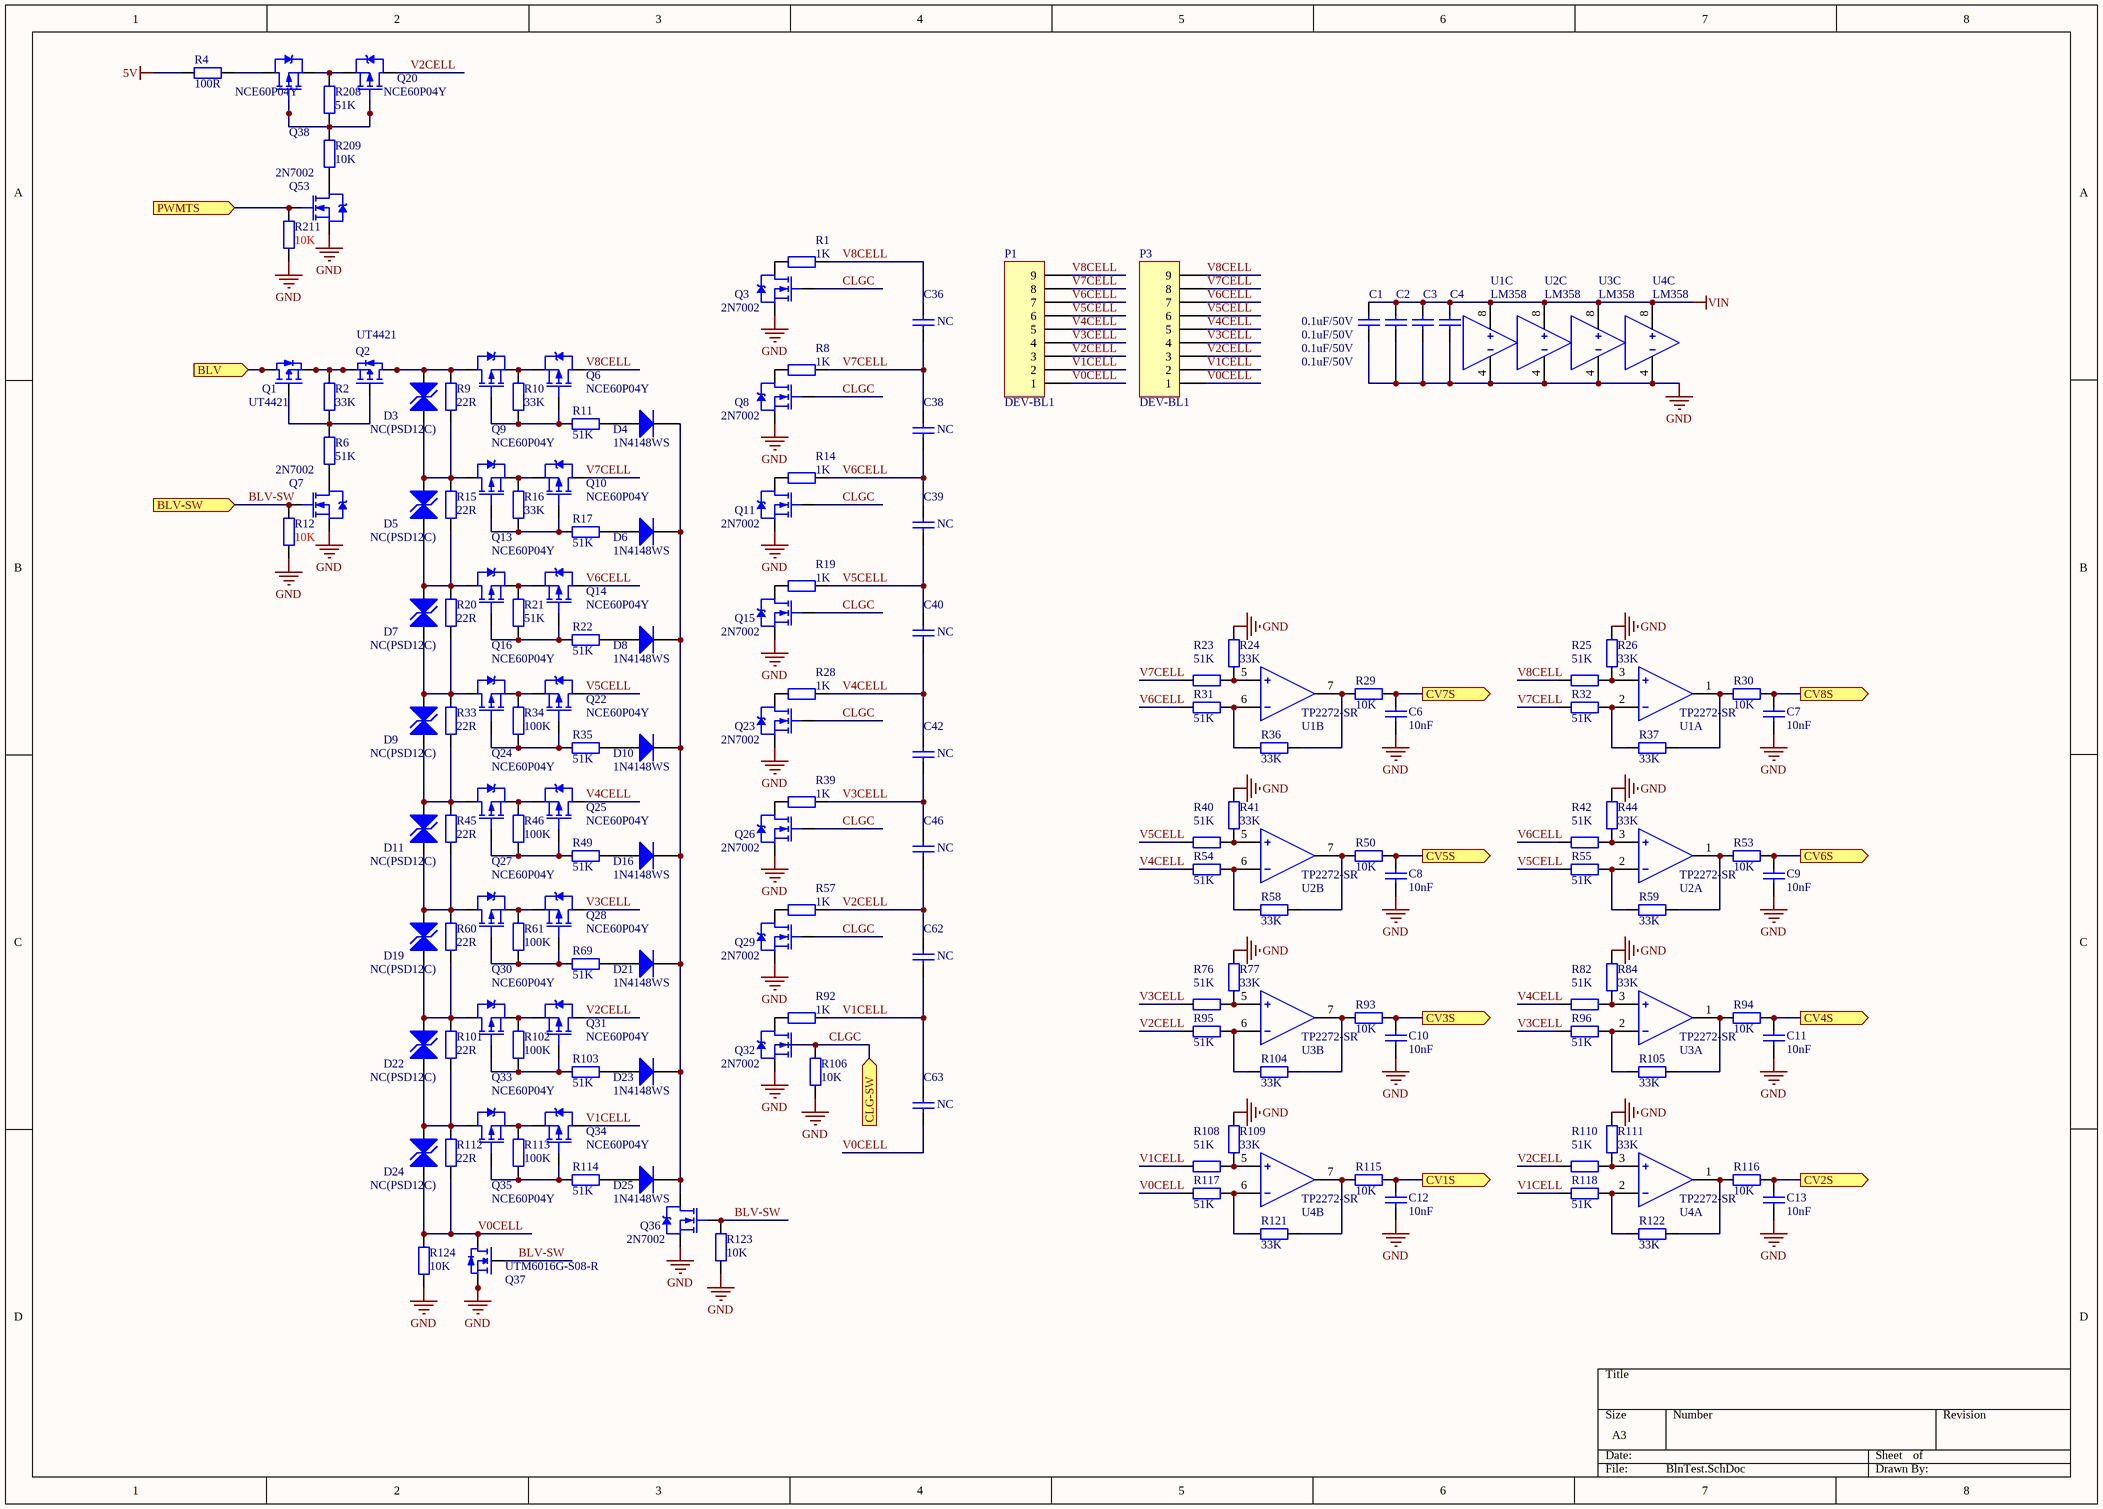
[diagram p5: BlnTest.SchDoc]

### Parts
C1  0.1uF/50V  [C-0603]
C2  0.1uF/50V  [C-0603]
C3  0.1uF/50V  [C-0603]
C4  0.1uF/50V  [C-0603]
C6  10nF  [C-0603]
C7  10nF  [C-0603]
C8  10nF  [C-0603]
C9  10nF  [C-0603]
C10  10nF  [C-0603]
C11  10nF  [C-0603]
C12  10nF  [C-0603]
C13  10nF  [C-0603]
C36  NC  [C-0805]
C38  NC  [C-0805]
C39  NC  [C-0805]
C40  NC  [C-0805]
C42  NC  [C-0805]
C46  NC  [C-0805]
C62  NC  [C-0805]
C63  NC  [C-0805]
D3  NC(PSD12C)  [SOD-323]
D4  1N4148WS  [SOD-323]
D5  NC(PSD12C)  [SOD-323]
D6  1N4148WS  [SOD-323]
D7  NC(PSD12C)  [SOD-323]
D8  1N4148WS  [SOD-323]
D9  NC(PSD12C)  [SOD-323]
D10  1N4148WS  [SOD-323]
D11  NC(PSD12C)  [SOD-323]
D16  1N4148WS  [SOD-323]
D19  NC(PSD12C)  [SOD-323]
D21  1N4148WS  [SOD-323]
D22  NC(PSD12C)  [SOD-323]
D23  1N4148WS  [SOD-323]
D24  NC(PSD12C)  [SOD-323]
D25  1N4148WS  [SOD-323]
P1  DEV-BL1  [XH 2.54-9P]
P3  DEV-BL1  [XH 2.54-9P]
Q1  UT4421  [SOIC8]
Q2  UT4421  [SOIC8]
Q3  2N7002  [SOT23-3]
Q6  NCE60P04Y  [SOT23-3]
Q7  2N7002  [SOT23-3]
Q8  2N7002  [SOT23-3]
Q9  NCE60P04Y  [SOT23-3]
Q10  NCE60P04Y  [SOT23-3]
Q11  2N7002  [SOT23-3]
Q13  NCE60P04Y  [SOT23-3]
Q14  NCE60P04Y  [SOT23-3]
Q15  2N7002  [SOT23-3]
Q16  NCE60P04Y  [SOT23-3]
Q20  NCE60P04Y  [SOT23-3]
Q22  NCE60P04Y  [SOT23-3]
Q23  2N7002  [SOT23-3]
Q24  NCE60P04Y  [SOT23-3]
Q25  NCE60P04Y  [SOT23-3]
Q26  2N7002  [SOT23-3]
Q27  NCE60P04Y  [SOT23-3]
Q28  NCE60P04Y  [SOT23-3]
Q29  2N7002  [SOT23-3]
Q30  NCE60P04Y  [SOT23-3]
Q31  NCE60P04Y  [SOT23-3]
Q32  2N7002  [SOT23-3]
Q33  NCE60P04Y  [SOT23-3]
Q34  NCE60P04Y  [SOT23-3]
Q35  NCE60P04Y  [SOT23-3]
Q36  2N7002  [SOT23-3]
Q37  UTM6016G-S08-R  [SOIC8]
Q38  NCE60P04Y  [SOT23-3]
Q53  2N7002  [SOT23-3]
R1  1K  [R-0603]
R2  33K  [R-0603]
R4  100R  [R-0603]
R6  51K  [R-0603]
R8  1K  [R-0603]
R9  22R  [RES 3W-S]
R10  33K  [R-0603]
R11  51K  [R-0603]
R12  10K  [R-0603]
R14  1K  [R-0603]
R15  22R  [RES 3W-S]
R16  33K  [R-0603]
R17  51K  [R-0603]
R19  1K  [R-0603]
R20  22R  [RES 3W-S]
R21  51K  [R-0603]
R22  51K  [R-0603]
R23  51K  [R-0603]
R24  33K  [R-0603]
R25  51K  [R-0603]
R26  33K  [R-0603]
R28  1K  [R-0603]
R29  10K  [R-0603]
R30  10K  [R-0603]
R31  51K  [R-0603]
R32  51K  [R-0603]
R33  22R  [RES 3W-S]
R34  100K  [R-0603]
R35  51K  [R-0603]
R36  33K  [R-0603]
R37  33K  [R-0603]
R39  1K  [R-0603]
R40  51K  [R-0603]
R41  33K  [R-0603]
R42  51K  [R-0603]
R44  33K  [R-0603]
R45  22R  [RES 3W-S]
R46  100K  [R-0603]
R49  51K  [R-0603]
R50  10K  [R-0603]
R53  10K  [R-0603]
R54  51K  [R-0603]
R55  51K  [R-0603]
R57  1K  [R-0603]
R58  33K  [R-0603]
R59  33K  [R-0603]
R60  22R  [RES 3W-S]
R61  100K  [R-0603]
R69  51K  [R-0603]
R76  51K  [R-0603]
R77  33K  [R-0603]
R82  51K  [R-0603]
R84  33K  [R-0603]
R92  1K  [R-0603]
R93  10K  [R-0603]
R94  10K  [R-0603]
R95  51K  [R-0603]
R96  51K  [R-0603]
R101  22R  [RES 3W-S]
R102  100K  [R-0603]
R103  51K  [R-0603]
R104  33K  [R-0603]
R105  33K  [R-0603]
R106  10K  [R-0603]
R108  51K  [R-0603]
R109  33K  [R-0603]
R110  51K  [R-0603]
R111  33K  [R-0603]
R112  22R  [RES 3W-S]
R113  100K  [R-0603]
R114  51K  [R-0603]
R115  10K  [R-0603]
R116  10K  [R-0603]
R117  51K  [R-0603]
R118  51K  [R-0603]
R121  33K  [R-0603]
R122  33K  [R-0603]
R123  10K  [R-0603]
R124  10K  [R-1206]
R208  51K  [R-0603]
R209  10K  [R-0603]
R211  10K  [R-0603]
U1  TP2272-SR  [SOIC8]  (parts A,B,C of 3)
U2  TP2272-SR  [SOIC8]  (parts A,B,C of 3)
U3  TP2272-SR  [SOIC8]  (parts A,B,C of 3)
U4  TP2272-SR  [SOIC8]  (parts A,B,C of 3)

### Ports
BLV (in), BLV-SW (in), CLG-SW (in), CV1S (out), CV2S (out), CV3S (out), CV4S (out), CV5S (out), CV6S (out), CV7S (out), CV8S (out), PWMTS (in)

### Nets
5V: R4.2
BLV: Q1.5(D) Q1.6(D) Q1.7(D) Q1.8(D) ; port BLV
GND: C1.2 C2.2 C3.2 C4.2 C6.1 C7.1 C8.1 C9.1 C10.1 C11.1 C12.1 C13.1 Q3.2(D) Q7.2(D) Q8.2(D) Q11.2(D) Q15.2(D) Q23.2(D) Q26.2(D) Q29.2(D) Q32.2(D) Q36.2(D) Q37.1(S) Q37.2(S) Q37.3(S) Q53.2(D) R12.2 R24.1 R26.1 R41.1 R44.1 R77.1 R84.1 R106.1 R109.1 R111.1 R123.2 R124.1 R211.2 U1.4 U2.4 U3.4 U4.4
VIN: C1.1 C2.1 C3.1 C4.1 U1.8 U2.8 U3.8 U4.8
BLV-SW: Q7.1(G) Q36.1(G) Q37.4(G) R12.1 R123.1 ; port BLV-SW
CLGC: Q3.1(G) Q8.1(G) Q11.1(G) Q15.1(G) Q23.1(G) Q26.1(G) Q29.1(G) Q32.1(G) R106.2 ; port CLG-SW
V0CELL: C63.2 D24.2 P1.1 P3.1 Q37.5(D) Q37.6(D) Q37.7(D) Q37.8(D) R112.1 R117.1 R124.2
V1CELL: C62.2 C63.1 P1.2 P3.2 Q34.3(D) R92.2 R108.2 R118.1
V2CELL: C46.2 C62.1 P1.3 P3.3 Q20.3(D) Q31.3(D) R57.2 R95.1 R110.2
V3CELL: C42.2 C46.1 P1.4 P3.4 Q28.3(D) R39.2 R76.2 R96.1
V4CELL: C40.2 C42.1 P1.5 P3.5 Q25.3(D) R28.2 R54.1 R82.2
V5CELL: C39.2 C40.1 P1.6 P3.6 Q22.3(D) R19.2 R40.2 R55.1
V6CELL: C38.2 C39.1 P1.7 P3.7 Q14.3(D) R14.2 R31.1 R42.2
V7CELL: C36.2 C38.1 P1.8 P3.8 Q10.3(D) R8.2 R23.2 R32.1
V8CELL: C36.1 P1.9 P3.9 Q6.3(D) R1.2 R25.2
NetC6_2: C6.2 R29.1 ; port CV7S
NetC7_2: C7.2 R30.1 ; port CV8S
NetC8_2: C8.2 R50.1 ; port CV5S
NetC9_2: C9.2 R53.1 ; port CV6S
NetC10_2: C10.2 R93.1 ; port CV3S
NetC11_2: C11.2 R94.1 ; port CV4S
NetC12_2: C12.2 R115.1 ; port CV1S
NetC13_2: C13.2 R116.1 ; port CV2S
NetD3_1: D3.1 Q2.5(D) Q2.6(D) Q2.7(D) Q2.8(D) Q9.3(D) R9.2
NetD3_2: D3.2 D5.1 Q13.3(D) R9.1 R15.2
NetD4_1: D4.1(A) R11.1
NetD4_2: D4.2(K) D6.2(K) D8.2(K) D10.2(K) D16.2(K) D21.2(K) D23.2(K) D25.2(K) Q36.3(S)
NetD5_2: D5.2 D7.1 Q16.3(D) R15.1 R20.2
NetD6_1: D6.1(A) R17.1
NetD7_2: D7.2 D9.1 Q24.3(D) R20.1 R33.2
NetD8_1: D8.1(A) R22.1
NetD9_2: D9.2 D11.1 Q27.3(D) R33.1 R45.2
NetD10_1: D10.1(A) R35.1
NetD11_2: D11.2 D19.1 Q30.3(D) R45.1 R60.2
NetD16_1: D16.1(A) R49.1
NetD19_2: D19.2 D22.1 Q33.3(D) R60.1 R101.2
NetD21_1: D21.1(A) R69.1
NetD22_2: D22.2 D24.1 Q35.3(D) R101.1 R112.2
NetD23_1: D23.1(A) R103.1
NetD25_1: D25.1(A) R114.1
NetQ1_1: Q1.1(S) Q1.2(S) Q1.3(S) Q2.1(S) Q2.2(S) Q2.3(S) R2.2
NetQ1_4: Q1.4(G) Q2.4(G) R2.1 R6.2
NetQ3_3: Q3.3(S) R1.1
NetQ6_1: Q6.1(G) Q9.1(G) R10.2 R11.2
NetQ6_2: Q6.2(S) Q9.2(S) R10.1
NetQ7_3: Q7.3(S) R6.1
NetQ8_3: Q8.3(S) R8.1
NetQ10_1: Q10.1(G) Q13.1(G) R16.2 R17.2
NetQ10_2: Q10.2(S) Q13.2(S) R16.1
NetQ11_3: Q11.3(S) R14.1
NetQ14_1: Q14.1(G) Q16.1(G) R21.2 R22.2
NetQ14_2: Q14.2(S) Q16.2(S) R21.1
NetQ15_3: Q15.3(S) R19.1
NetQ20_1: Q20.1(G) Q38.1(G) R208.1 R209.2
NetQ20_2: Q20.2(S) Q38.2(S) R208.2
NetQ22_1: Q22.1(G) Q24.1(G) R34.2 R35.2
NetQ22_2: Q22.2(S) Q24.2(S) R34.1
NetQ23_3: Q23.3(S) R28.1
NetQ25_1: Q25.1(G) Q27.1(G) R46.2 R49.2
NetQ25_2: Q25.2(S) Q27.2(S) R46.1
NetQ26_3: Q26.3(S) R39.1
NetQ28_1: Q28.1(G) Q30.1(G) R61.2 R69.2
NetQ28_2: Q28.2(S) Q30.2(S) R61.1
NetQ29_3: Q29.3(S) R57.1
NetQ31_1: Q31.1(G) Q33.1(G) R102.2 R103.2
NetQ31_2: Q31.2(S) Q33.2(S) R102.1
NetQ32_3: Q32.3(S) R92.1
NetQ34_1: Q34.1(G) Q35.1(G) R113.2 R114.2
NetQ34_2: Q34.2(S) Q35.2(S) R113.1
NetQ38_3: Q38.3(D) R4.1
NetQ53_1: Q53.1(G) R211.1 ; port PWMTS
NetQ53_3: Q53.3(S) R209.1
NetR23_1: R23.1 R24.2 U1.5
NetR25_1: R25.1 R26.2 U1.3
NetR29_2: R29.2 R36.2 U1.7
NetR30_2: R30.2 R37.2 U1.1
NetR31_2: R31.2 R36.1 U1.6
NetR32_2: R32.2 R37.1 U1.2
NetR40_1: R40.1 R41.2 U2.5
NetR42_1: R42.1 R44.2 U2.3
NetR50_2: R50.2 R58.2 U2.7
NetR53_2: R53.2 R59.2 U2.1
NetR54_2: R54.2 R58.1 U2.6
NetR55_2: R55.2 R59.1 U2.2
NetR76_1: R76.1 R77.2 U3.5
NetR82_1: R82.1 R84.2 U3.3
NetR93_2: R93.2 R104.2 U3.7
NetR94_2: R94.2 R105.2 U3.1
NetR95_2: R95.2 R104.1 U3.6
NetR96_2: R96.2 R105.1 U3.2
NetR108_1: R108.1 R109.2 U4.5
NetR110_1: R110.1 R111.2 U4.3
NetR115_2: R115.2 R121.2 U4.7
NetR116_2: R116.2 R122.2 U4.1
NetR117_2: R117.2 R121.1 U4.6
NetR118_2: R118.2 R122.1 U4.2

### Library data of the parts
C1-C4 C6-C13 C36 C38-C40 C42 C46 C62 C63 = Cap: Capacitor; Published: 8-Jun-2000; LatestRevisionDate: 17-Jul-2002; LatestRevisionNote: Re-released for DXP Platform.; PackageReference: RAD-0.3; Publisher: Altium Limited
  C1-C4: Value: 0.1uF/50V
  C6-C13: Value: 10nF
  C36 C38-C40 C42 C46 C62 C63: Value: NC
D3 D5 D7 D9 D11 D19 D22 D24 = TVS-D
D4 D6 D8 D10 D16 D21 D23 D25 = Diode: Default Diode; Published: 8-Jun-2000; LatestRevisionDate: 17-Jul-2002; LatestRevisionNote: Re-released for DXP Platform.; PackageVersion: Sep-1996; PackageReference: SMC; Publisher: Altium Limited; PackageDescription: DO-214-AB/SMC; 2 C-Bend Leads; Body 7.9 x 5.9 mm, inc. leads (LxW); Code_JEDEC: DO-214-AB
P1 P3 = Header 9: Header, 9-Pin; LatestRevisionDate: 17-Jul-2002; LatestRevisionNote: Re-released for DXP Platform.; Publisher: Altium Limited
Q1 Q2 = SO8-PMOS
Q3 Q7 Q8 Q11 Q15 Q23 Q26 Q29 Q32 Q36 Q53 = NMOS-2: as Q5 on sheet IOTest; Published: 8-Jun-2000; LatestRevisionDate: 17-Jul-2002; LatestRevisionNote: Re-released for DXP Platform.; DatasheetVersion: PD-9.814; PackageVersion: Feb-1997; PackageReference: TO-220AB; Publisher: Altium Limited; PackageDescription: TO, Thru-Hole, Vertical, Heatsink Mounted; 3 In-Line Leads; Pitch 2.54 mm; ComponentLink1Description: Manufacturer Link; ComponentLink1URL: http://www.irf.com/
Q6 Q9 Q10 Q13 Q14 Q16 Q20 Q22 Q24 Q25 Q27 Q28 Q30 Q31 Q33-Q35 Q38 = PMOS-2: P-Channel Power MOSFET; Note: Pin 4 not drawn and electrically connected to Pin 2.; Published: 8-Jun-2000; LatestRevisionDate: 17-Jul-2002; LatestRevisionNote: Re-released for DXP Platform.; DatasheetVersion: PD-9.390D; PackageVersion: Feb-1997; PackageReference: TO-220AB; Publisher: Altium Limited; PackageDescription: TO, Thru-Hole, Vertical, Heatsink Mounted; 3 In-Line Leads; Pitch 2.54 mm; ComponentLink1Description: Manufacturer Link; ComponentLink1URL: http://www.irf.com/
Q37 = SO8-NMOS
R1 R2 R4 R6 R8-R12 R14-R17 R19-R26 R28-R37 R39-R42 R44-R46 R49 R50 R53-R55 R57-R61 R69 R76 R77 R82 R84 R92-R96 R101-R106 R108-R118 R121-R124 R208 R209 R211 = Res2: Resistor; Published: 8-Jun-2000; LatestRevisionDate: 17-Jul-2002; LatestRevisionNote: Re-released for DXP Platform.; Publisher: Altium Limited
  R1 R8 R14 R19 R28 R39 R57 R92: PackageReference: AXIAL-0.4; Value: 1K
  R2 R24 R26 R36 R37 R41 R44 R58 R59 R77 R84 R104 R105 R109 R111 R121 R122: PackageReference: AXIAL-0.4; Value: 33K
  R4: PackageReference: AXIAL-0.4; Value: 100R
  R6 R23 R25 R31 R32 R40 R42 R54 R55 R76 R82 R95 R96 R108 R110 R117 R118 R208: PackageReference: AXIAL-0.4; Value: 51K
  R9 R15 R20 R33 R45 R60 R101 R112: Value: 22R
  R10 R16: PackageReference: AXIAL-0.4; PackageDescription: Axial Device, Thru-Hole; 2 Leads; 0.4 in Pin Spacing; Value: 33K
  R11 R17 R21 R22 R35 R49 R69 R103 R114: PackageReference: AXIAL-0.4; PackageDescription: Axial Device, Thru-Hole; 2 Leads; 0.4 in Pin Spacing; Value: 51K
  R12 R29 R30 R50 R53 R93 R94 R106 R115 R116 R123 R124 R209 R211: PackageReference: AXIAL-0.4; Value: 10K
  R34 R46 R61 R102 R113: PackageReference: AXIAL-0.4; PackageDescription: Axial Device, Thru-Hole; 2 Leads; 0.4 in Pin Spacing; Value: 100K
U1-U4 = Dual_OPAMP

## Nets that join several sheets
3.3V: IOTest (R131.2), MCU (18 pins), Power (C55.2 C57.2 U13.3)
5V: IOTest (5 pins), MCU (D14.2 R66.2 R75.1 R97.2), Power (9 pins), BlnTest (R4.2)
BLHV: IOTest (5 pins), Power (D31.1 F3.2 R168.1)
BLV: Power (D37.2), BlnTest (Q1.5 Q1.6 Q1.7 Q1.8)
GND: IOTest (43 pins), MCU (45 pins), Power (33 pins), BlnTest (43 pins)
VIN: IOTest (C14.1 R138.1 U6.8), MCU (C72.1 D39.1 U11.8), Power (13 pins), BlnTest (8 pins)
VREF: MCU (U5.14), Power (5 pins)
BLV-SW: MCU (U5.33), BlnTest (5 pins)
CLGC: MCU (U5.29), BlnTest (9 pins)
NetC6_2: MCU (U5.27), BlnTest (C6.2 R29.1)
NetC7_2: MCU (U5.26), BlnTest (C7.2 R30.1)
NetC8_2: MCU (U5.25), BlnTest (C8.2 R50.1)
NetC9_2: MCU (U5.24), BlnTest (C9.2 R53.1)
NetC10_2: MCU (U5.23), BlnTest (C10.2 R93.1)
NetC11_2: MCU (U5.22), BlnTest (C11.2 R94.1)
NetC12_2: MCU (U5.17), BlnTest (C12.2 R115.1)
NetC13_2: MCU (U5.16), BlnTest (C13.2 R116.1)
NetC15_2: IOTest (C15.2 R128.1 R133.2), MCU (U5.9)
NetC17_2: IOTest (C17.2 R135.2), MCU (U5.8)
NetC27_2: MCU (U5.15), Power (C27.2 R168.2 R170.2)
NetC47_2: IOTest (C47.2 R80.1 R85.2), MCU (U5.10)
NetC64_2: MCU (U5.11), Power (C64.2 R71.2 R72.2)
NetP2_3: IOTest (P2.3 P8.3), MCU (R154.1 R156.1)
NetQ5_1: IOTest (Q5.1 R89.2), MCU (U5.59)
NetQ17_1: IOTest (Q17.1 R70.2), MCU (U5.61)
NetQ18_1: IOTest (Q18.1 R119.2), MCU (U5.62)
NetQ43_1: IOTest (Q43.1 R153.1), MCU (U5.38)
NetQ47_1: MCU (U5.58), Power (Q47.1 R181.2)
NetQ53_1: MCU (U5.30), BlnTest (Q53.1 R211.1)
NetR43_2: IOTest (R43.2 U7.1 U7.12), MCU (U5.56)
QCDM: IOTest (J4.2 J5.2 P11.2), MCU (R18.2)
QCDP: IOTest (J4.3 J5.3 P11.3), MCU (R13.2)